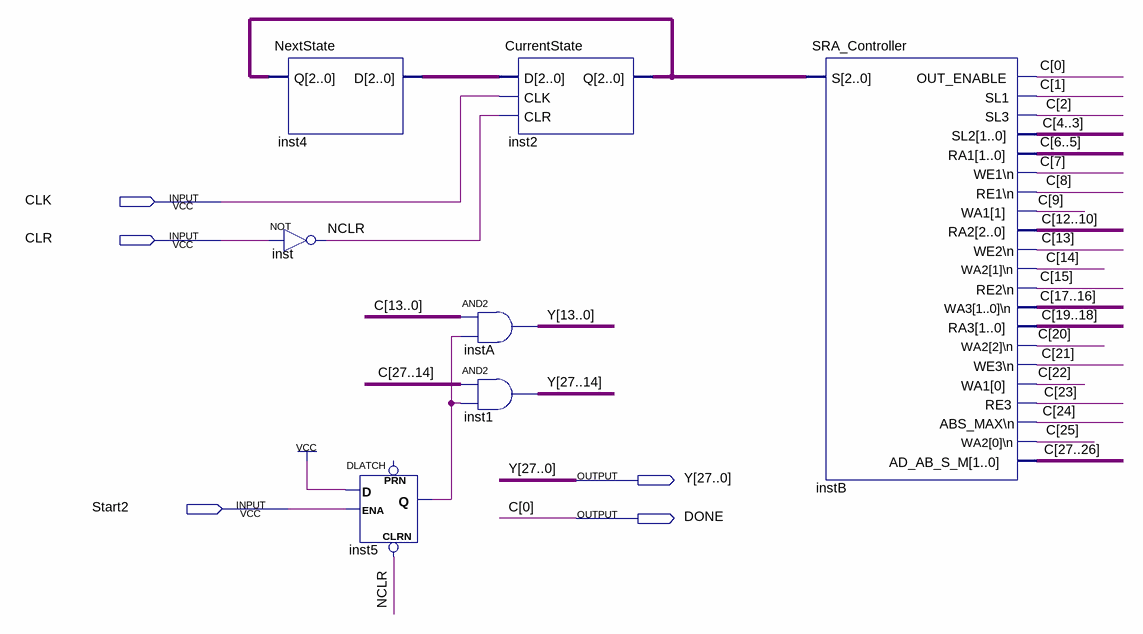
[diagram p0: schematic sheet]
// Quartus schematic SRA_FINAL_CONTROLLER.bdf as structural Verilog: 7 symbols, 5 pins
module SRA_FINAL_CONTROLLER (
  input  CLK,
  input  CLR,
  input  Start2,
  output [27:0] Y,
  output DONE
);

  wire inst5_q, NCLR;
  wire [2:0] inst2_q, inst4_d;
  wire [27:1] C;

  NextState inst4 (.Q(inst2_q), .D(inst4_d));
  not inst (NCLR, CLR);
  DLATCH inst5 (.CLRN(NCLR), .D(1'b1), .ENA(Start2), .Q(inst5_q));  // open: PRN
  assign Y[13:0] = {C[13:1], DONE} & {14{inst5_q}};  // AND2 instA, 14 bits wide
  assign Y[27:14] = C[27:14] & {14{inst5_q}};  // AND2 inst1, 14 bits wide
  CurrentState inst2 (.D(inst4_d), .CLK(CLK), .CLR(NCLR), .Q(inst2_q));
  SRA_Controller instB (
    .S(inst2_q), .OUT_ENABLE(DONE), .SL1(C[1]), .SL3(C[2]), .SL2(C[4:3]), .RA1(C[6:5]), .\WE1\n (C[7]),
    .\RE1\n (C[8]), .WA1({C[9], C[22]}), .RA2(C[12:10]), .\WE2\n (C[13]), .\WA2[1]\n (C[14]),
    .\RE2\n (C[15]), .\WA3[1..0]\n (C[17:16]), .RA3(C[19:18]), .\WA2[2]\n (C[20]), .\WE3\n (C[21]),
    .RE3(C[23]), .\ABS_MAX\n (C[24]), .\WA2[0]\n (C[25]), .AD_AB_S_M(C[27:26]));

  // Other names for the same wires on the sheet: C[0] = DONE
endmodule
